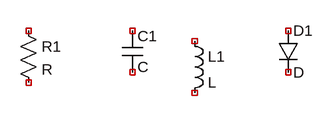
[diagram p0: schematic Jedan asc.asc]
Jedan asc.asc, the LTspice schematic file:
Version 4
SHEET 1 880 680
SYMBOL res -16 80 R0
SYMATTR InstName R1
SYMBOL cap 144 96 R0
SYMATTR InstName C1
SYMBOL ind 240 96 R0
SYMATTR InstName L1
SYMBOL diode 384 96 R0
SYMATTR InstName D1

The netlist it stands for:
* Jedan asc.asc
R1 NC_01 NC_02 R
C1 NC_03 NC_04 C
L1 NC_05 NC_06 L
D1 NC_07 NC_08 D
.model D D
.lib standard.dio
.backanno
.end